# EAGLE design carrier_board (EAGLE 9.5.2)

## Sheet 1 of 5: Main Board
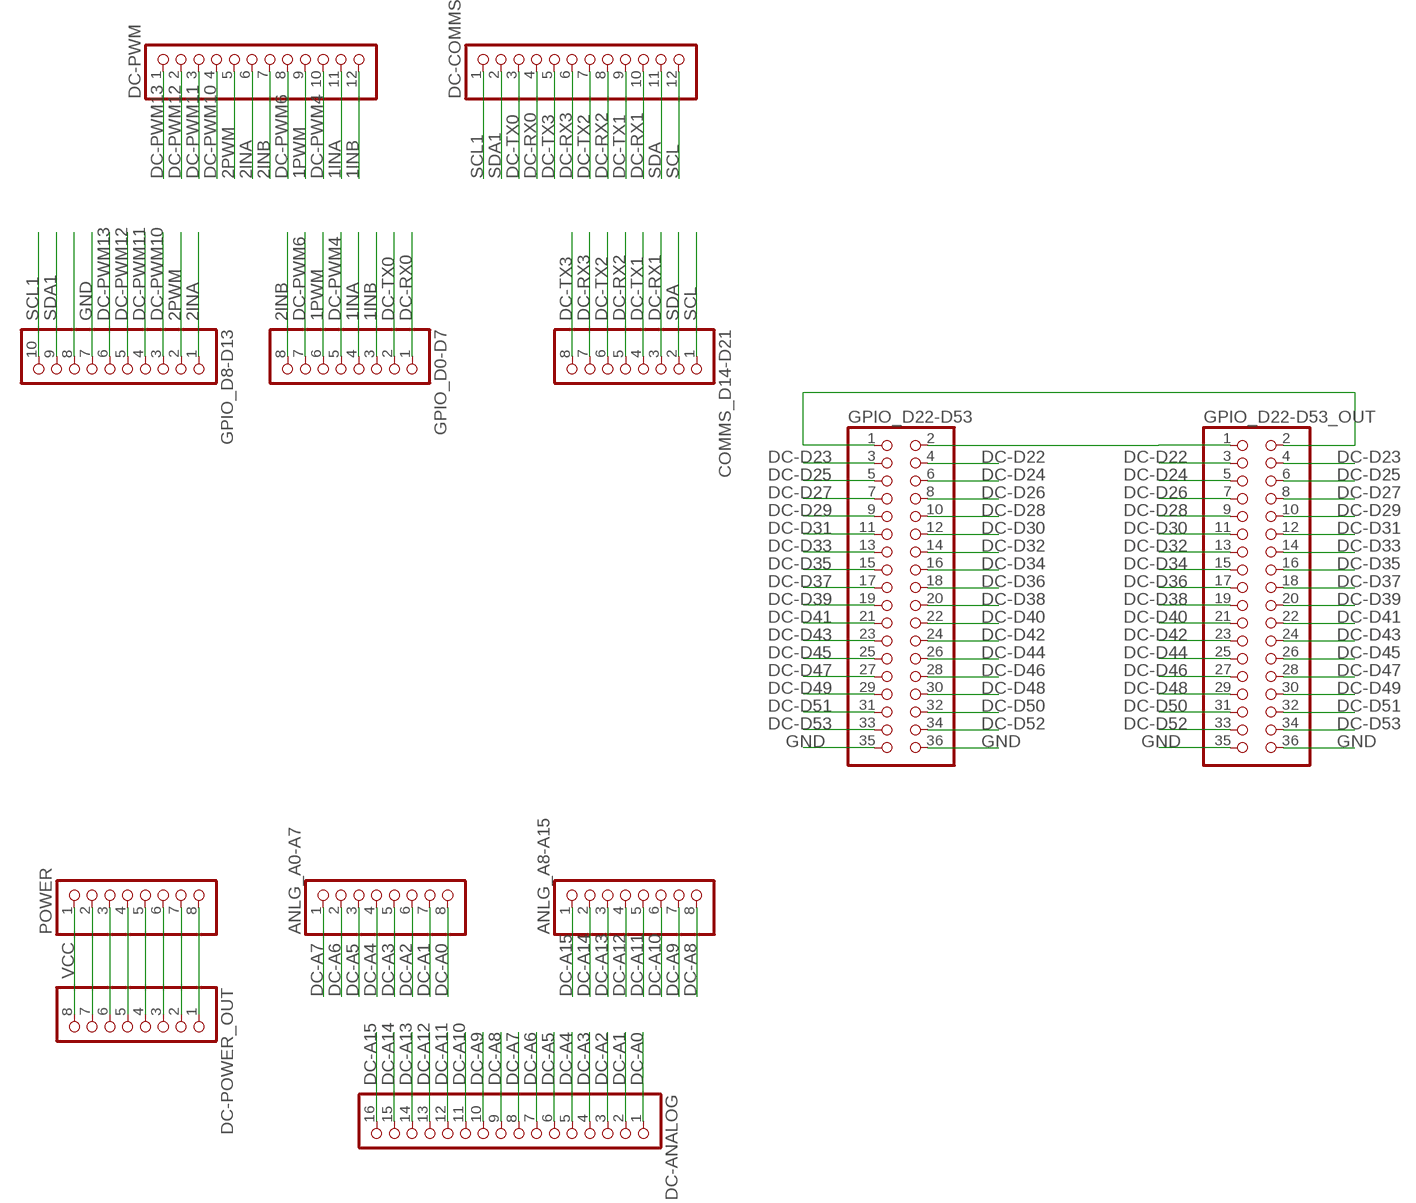
[diagram p0: schematic, sheet 1]

### Parts
ANLG_A0-A7  PINHD-1X8  [1X08]
ANLG_A8-A15  PINHD-1X8  [1X08]
COMMS_D14-D21  PINHD-1X8  [1X08]
DC-ANALOG  PINHD-1X16  [1X16]
DC-COMMS  PINHD-1X12  [1X12]
DC-POWER_OUT  PINHD-1X8  [1X08]
DC-PWM  PINHD-1X12  [1X12]
GPIO_D0-D7  PINHD-1X8  [1X08]
GPIO_D8-D13  PINHD-1X10  [1X10]
GPIO_D22-D53  PINHD-2X18  [2X18]
GPIO_D22-D53_OUT  PINHD-2X18  [2X18]
POWER  PINHD-1X8  [1X08]

### Nets
1INA: DC-PWM.11 GPIO_D0-D7.4 ; also sheet 5
1INB: DC-PWM.12 GPIO_D0-D7.3 ; also sheet 5
1PWM: DC-PWM.9 GPIO_D0-D7.6 ; also sheet 5
2INA: DC-PWM.6 GPIO_D8-D13.1 ; also sheet 5
2INB: DC-PWM.7 GPIO_D0-D7.8 ; also sheet 5
2PWM: DC-PWM.5 GPIO_D8-D13.2 ; also sheet 5
DC-A0: ANLG_A0-A7.8 DC-ANALOG.1
DC-A1: ANLG_A0-A7.7 DC-ANALOG.2
DC-A2: ANLG_A0-A7.6 DC-ANALOG.3
DC-A3: ANLG_A0-A7.5 DC-ANALOG.4
DC-A4: ANLG_A0-A7.4 DC-ANALOG.5
DC-A5: ANLG_A0-A7.3 DC-ANALOG.6
DC-A6: ANLG_A0-A7.2 DC-ANALOG.7
DC-A7: ANLG_A0-A7.1 DC-ANALOG.8
DC-A8: ANLG_A8-A15.8 DC-ANALOG.9
DC-A9: ANLG_A8-A15.7 DC-ANALOG.10
DC-A10: ANLG_A8-A15.6 DC-ANALOG.11
DC-A11: ANLG_A8-A15.5 DC-ANALOG.12
DC-A12: ANLG_A8-A15.4 DC-ANALOG.13
DC-A13: ANLG_A8-A15.3 DC-ANALOG.14
DC-A14: ANLG_A8-A15.2 DC-ANALOG.15
DC-A15: ANLG_A8-A15.1 DC-ANALOG.16
DC-D22: GPIO_D22-D53.4 GPIO_D22-D53_OUT.3
DC-D23: GPIO_D22-D53.3 GPIO_D22-D53_OUT.4
DC-D24: GPIO_D22-D53.6 GPIO_D22-D53_OUT.5
DC-D25: GPIO_D22-D53.5 GPIO_D22-D53_OUT.6
DC-D26: GPIO_D22-D53.8 GPIO_D22-D53_OUT.7
DC-D27: GPIO_D22-D53.7 GPIO_D22-D53_OUT.8
DC-D28: GPIO_D22-D53.10 GPIO_D22-D53_OUT.9
DC-D29: GPIO_D22-D53.9 GPIO_D22-D53_OUT.10
DC-D30: GPIO_D22-D53.12 GPIO_D22-D53_OUT.11
DC-D31: GPIO_D22-D53.11 GPIO_D22-D53_OUT.12
DC-D32: GPIO_D22-D53.14 GPIO_D22-D53_OUT.13
DC-D33: GPIO_D22-D53.13 GPIO_D22-D53_OUT.14
DC-D34: GPIO_D22-D53.16 GPIO_D22-D53_OUT.15
DC-D35: GPIO_D22-D53.15 GPIO_D22-D53_OUT.16
DC-D36: GPIO_D22-D53.18 GPIO_D22-D53_OUT.17
DC-D37: GPIO_D22-D53.17 GPIO_D22-D53_OUT.18
DC-D38: GPIO_D22-D53.20 GPIO_D22-D53_OUT.19
DC-D39: GPIO_D22-D53.19 GPIO_D22-D53_OUT.20
DC-D40: GPIO_D22-D53.22 GPIO_D22-D53_OUT.21
DC-D41: GPIO_D22-D53.21 GPIO_D22-D53_OUT.22
DC-D42: GPIO_D22-D53.24 GPIO_D22-D53_OUT.23
DC-D43: GPIO_D22-D53.23 GPIO_D22-D53_OUT.24
DC-D44: GPIO_D22-D53.26 GPIO_D22-D53_OUT.25
DC-D45: GPIO_D22-D53.25 GPIO_D22-D53_OUT.26
DC-D46: GPIO_D22-D53.28 GPIO_D22-D53_OUT.27
DC-D47: GPIO_D22-D53.27 GPIO_D22-D53_OUT.28
DC-D48: GPIO_D22-D53.30 GPIO_D22-D53_OUT.29
DC-D49: GPIO_D22-D53.29 GPIO_D22-D53_OUT.30
DC-D50: GPIO_D22-D53.32 GPIO_D22-D53_OUT.31
DC-D51: GPIO_D22-D53.31 GPIO_D22-D53_OUT.32
DC-D52: GPIO_D22-D53.34 GPIO_D22-D53_OUT.33
DC-D53: GPIO_D22-D53.33 GPIO_D22-D53_OUT.34
DC-PWM4: DC-PWM.10 GPIO_D0-D7.5
DC-PWM6: DC-PWM.8 GPIO_D0-D7.7
DC-PWM10: DC-PWM.4 GPIO_D8-D13.3
DC-PWM11: DC-PWM.3 GPIO_D8-D13.4
DC-PWM12: DC-PWM.2 GPIO_D8-D13.5
DC-PWM13: DC-PWM.1 GPIO_D8-D13.6
DC-RX0: DC-COMMS.4 GPIO_D0-D7.1
DC-RX1: COMMS_D14-D21.3 DC-COMMS.10
DC-RX2: COMMS_D14-D21.5 DC-COMMS.8
DC-RX3: COMMS_D14-D21.7 DC-COMMS.6
DC-TX0: DC-COMMS.3 GPIO_D0-D7.2
DC-TX1: COMMS_D14-D21.4 DC-COMMS.9
DC-TX2: COMMS_D14-D21.6 DC-COMMS.7
DC-TX3: COMMS_D14-D21.8 DC-COMMS.5
GND: GPIO_D8-D13.7 GPIO_D22-D53.35 GPIO_D22-D53.36 GPIO_D22-D53_OUT.35 GPIO_D22-D53_OUT.36 ; also sheet 2,3,4,5
N$6: GPIO_D22-D53.1 GPIO_D22-D53_OUT.2
N$7: GPIO_D22-D53.2 GPIO_D22-D53_OUT.1
N$9: DC-POWER_OUT.1 POWER.8
N$16: GPIO_D8-D13.8
N$52: DC-POWER_OUT.2 POWER.7
N$53: DC-POWER_OUT.3 POWER.6
N$54: DC-POWER_OUT.4 POWER.5
N$55: DC-POWER_OUT.5 POWER.4
N$56: DC-POWER_OUT.6 POWER.3
N$57: DC-POWER_OUT.7 POWER.2
SCL: COMMS_D14-D21.1 DC-COMMS.12 ; also sheet 2,3
SCL1: DC-COMMS.1 GPIO_D8-D13.10
SDA: COMMS_D14-D21.2 DC-COMMS.11 ; also sheet 2,3
SDA1: DC-COMMS.2 GPIO_D8-D13.9
VCC: DC-POWER_OUT.8 POWER.1 ; also sheet 2,3,4,5

## Sheet 2 of 5: Encoder Nano
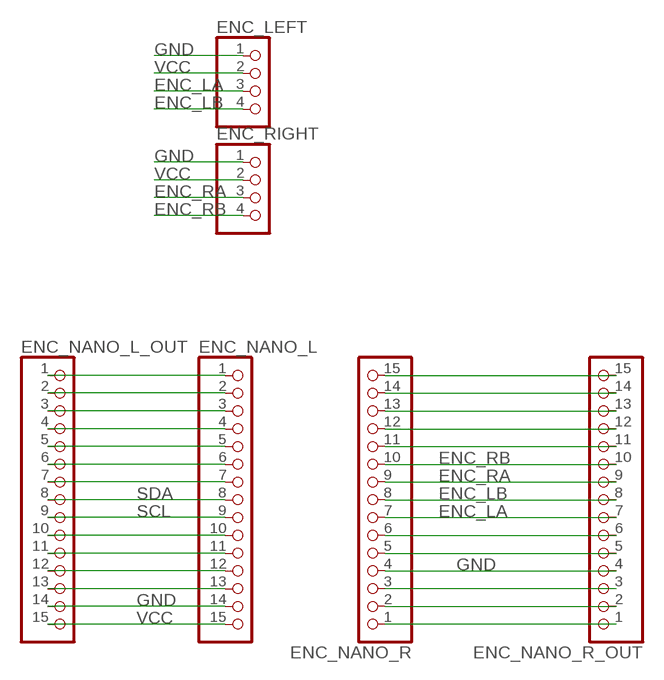
[diagram p1: schematic, sheet 2]

### Parts
ENC_LEFT  PINHD-1X4/90  [1X04/90]
ENC_NANO_L  PINHD-1X15  [1X15]
ENC_NANO_L_OUT  PINHD-1X15  [1X15]
ENC_NANO_R  PINHD-1X15  [1X15]
ENC_NANO_R_OUT  PINHD-1X15  [1X15]
ENC_RIGHT  PINHD-1X4/90  [1X04/90]

### Nets
ENC_LA: ENC_LEFT.3 ENC_NANO_R.7 ENC_NANO_R_OUT.7
ENC_LB: ENC_LEFT.4 ENC_NANO_R.8 ENC_NANO_R_OUT.8
ENC_RA: ENC_NANO_R.9 ENC_NANO_R_OUT.9 ENC_RIGHT.3
ENC_RB: ENC_NANO_R.10 ENC_NANO_R_OUT.10 ENC_RIGHT.4
GND: ENC_LEFT.1 ENC_NANO_L.14 ENC_NANO_L_OUT.14 ENC_NANO_R.4 ENC_NANO_R_OUT.4 ENC_RIGHT.1 ; also sheet 1,3,4,5
N$10: ENC_NANO_L.13 ENC_NANO_L_OUT.13
N$11: ENC_NANO_L.12 ENC_NANO_L_OUT.12
N$12: ENC_NANO_L.11 ENC_NANO_L_OUT.11
N$13: ENC_NANO_L.10 ENC_NANO_L_OUT.10
N$14: ENC_NANO_L.7 ENC_NANO_L_OUT.7
N$15: ENC_NANO_L.6 ENC_NANO_L_OUT.6
N$17: ENC_NANO_L.5 ENC_NANO_L_OUT.5
N$18: ENC_NANO_L.4 ENC_NANO_L_OUT.4
N$19: ENC_NANO_L.3 ENC_NANO_L_OUT.3
N$20: ENC_NANO_L.2 ENC_NANO_L_OUT.2
N$21: ENC_NANO_L.1 ENC_NANO_L_OUT.1
N$22: ENC_NANO_R.15 ENC_NANO_R_OUT.15
N$23: ENC_NANO_R.14 ENC_NANO_R_OUT.14
N$24: ENC_NANO_R.13 ENC_NANO_R_OUT.13
N$26: ENC_NANO_R.12 ENC_NANO_R_OUT.12
N$27: ENC_NANO_R.11 ENC_NANO_R_OUT.11
N$28: ENC_NANO_R.6 ENC_NANO_R_OUT.6
N$29: ENC_NANO_R.5 ENC_NANO_R_OUT.5
N$30: ENC_NANO_R.3 ENC_NANO_R_OUT.3
N$31: ENC_NANO_R.2 ENC_NANO_R_OUT.2
N$32: ENC_NANO_R.1 ENC_NANO_R_OUT.1
SCL: ENC_NANO_L.9 ENC_NANO_L_OUT.9 ; also sheet 1,3
SDA: ENC_NANO_L.8 ENC_NANO_L_OUT.8 ; also sheet 1,3
VCC: ENC_LEFT.2 ENC_NANO_L.15 ENC_NANO_L_OUT.15 ENC_RIGHT.2 ; also sheet 1,3,4,5

## Sheet 3 of 5: Ultrasonic Nano
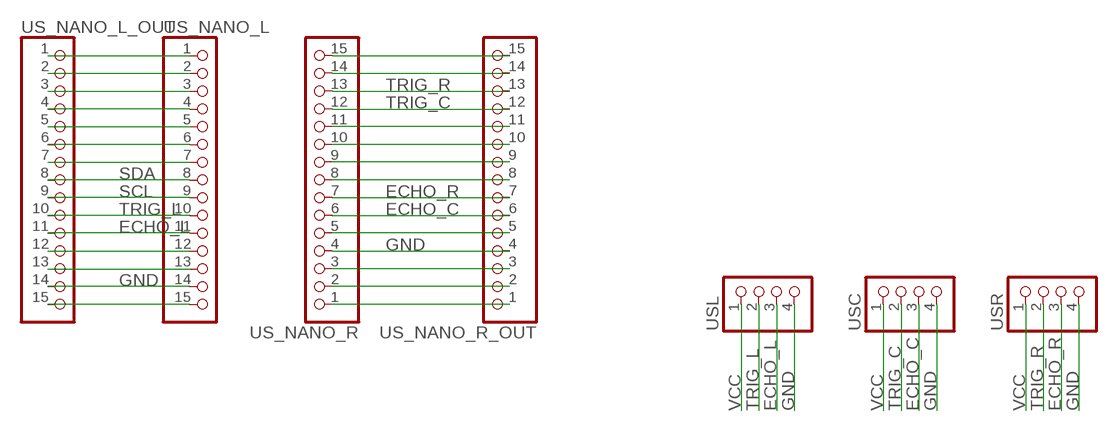
[diagram p2: schematic, sheet 3]

### Parts
US_NANO_L  PINHD-1X15  [1X15]
US_NANO_L_OUT  PINHD-1X15  [1X15]
US_NANO_R  PINHD-1X15  [1X15]
US_NANO_R_OUT  PINHD-1X15  [1X15]
USC  PINHD-1X4/90  [1X04/90]
USL  PINHD-1X4/90  [1X04/90]
USR  PINHD-1X4/90  [1X04/90]

### Nets
ECHO_C: US_NANO_R.6 US_NANO_R_OUT.6 USC.3
ECHO_L: US_NANO_L.11 US_NANO_L_OUT.11 USL.3
ECHO_R: US_NANO_R.7 US_NANO_R_OUT.7 USR.3
GND: US_NANO_L.14 US_NANO_L_OUT.14 US_NANO_R.4 US_NANO_R_OUT.4 USC.4 USL.4 USR.4 ; also sheet 1,2,4,5
N$33: US_NANO_R.15 US_NANO_R_OUT.15
N$34: US_NANO_R.14 US_NANO_R_OUT.14
N$35: US_NANO_R.11 US_NANO_R_OUT.11
N$36: US_NANO_R.10 US_NANO_R_OUT.10
N$37: US_NANO_R.9 US_NANO_R_OUT.9
N$38: US_NANO_R.8 US_NANO_R_OUT.8
N$39: US_NANO_R.5 US_NANO_R_OUT.5
N$40: US_NANO_R.3 US_NANO_R_OUT.3
N$41: US_NANO_R.2 US_NANO_R_OUT.2
N$42: US_NANO_R.1 US_NANO_R_OUT.1
N$43: US_NANO_L.1 US_NANO_L_OUT.1
N$44: US_NANO_L.2 US_NANO_L_OUT.2
N$45: US_NANO_L.3 US_NANO_L_OUT.3
N$46: US_NANO_L.4 US_NANO_L_OUT.4
N$47: US_NANO_L.5 US_NANO_L_OUT.5
N$48: US_NANO_L.6 US_NANO_L_OUT.6
N$49: US_NANO_L.7 US_NANO_L_OUT.7
N$50: US_NANO_L.12 US_NANO_L_OUT.12
N$51: US_NANO_L.13 US_NANO_L_OUT.13
SCL: US_NANO_L.9 US_NANO_L_OUT.9 ; also sheet 1,2
SDA: US_NANO_L.8 US_NANO_L_OUT.8 ; also sheet 1,2
TRIG_C: US_NANO_R.12 US_NANO_R_OUT.12 USC.2
TRIG_L: US_NANO_L.10 US_NANO_L_OUT.10 USL.2
TRIG_R: US_NANO_R.13 US_NANO_R_OUT.13 USR.2
VCC: USC.1 USL.1 USR.1 ; also sheet 1,2,4,5
VCC1: US_NANO_L.15 US_NANO_L_OUT.15

## Sheet 4 of 5: 5v Power board TODO: Remove 3.3 switch
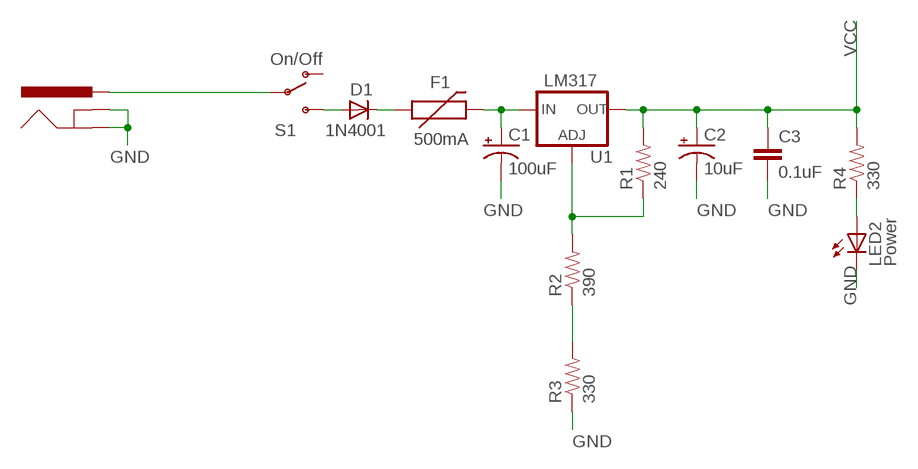
[diagram p3: schematic, sheet 4]

### Parts
C1  100uF  CAP_POLPTH1  [CPOL-RADIAL-100UF-25V]
C2  10uF  CAP_POLPTH2  [CPOL-RADIAL-10UF-25V]
C3  0.1uF  CAPPTH2  [CAP-PTH-SMALL2]
D1  1N4001  DIODEPTH  [DIODE-0.4]
F1  500mA  PTCPTH  [PTC]
J1  POWER_JACKPTH  [POWER_JACK_PTH]
LED2  Power  LED5MM  [LED5MM]
R1  240  RESISTORPTH1  [AXIAL-0.3]
R2  390  RESISTORPTH1  [AXIAL-0.3]
R3  330  RESISTORPTH1  [AXIAL-0.3]
R4  330  RESISTORPTH1  [AXIAL-0.3]
S1  On/Off  SWITCH-SPSTPTH  [SWITCH-SPST]
U1  LM317  V_REG_317SINK  [TO220-ADJ]

### Nets
GND: C1.2(-) C2.2(-) C3.2 J1.GND J1.GNDBREAK LED2.K(C) R3.P$1 ; also sheet 1,2,3,5
N$1: D1.C F1.P$1
N$2: D1.A S1.3(S)
N$3: J1.PWR S1.2(P)
N$4: R2.P$1 R3.P$2
N$5: R1.P$1 R2.P$2 U1.ADJ
N$8: LED2.A R4.P$1
RAW: C1.1(+) F1.P$2 U1.IN
VCC: C2.1(+) C3.1 R1.P$2 R4.P$2 U1.OUT ; also sheet 1,2,3,5
Unconnected: S1.1(O)

## Sheet 5 of 5: Motors/Motor Controllers
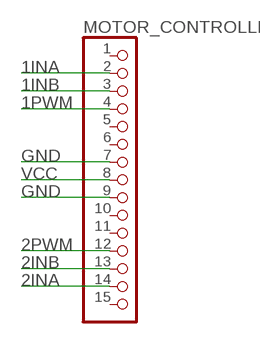
[diagram p4: schematic, sheet 5]

### Parts
MOTOR_CONTROLLER  PINHD-1X15  [1X15]

### Nets
1INA: MOTOR_CONTROLLER.2 ; also sheet 1
1INB: MOTOR_CONTROLLER.3 ; also sheet 1
1PWM: MOTOR_CONTROLLER.4 ; also sheet 1
2INA: MOTOR_CONTROLLER.14 ; also sheet 1
2INB: MOTOR_CONTROLLER.13 ; also sheet 1
2PWM: MOTOR_CONTROLLER.12 ; also sheet 1
GND: MOTOR_CONTROLLER.7 MOTOR_CONTROLLER.9 ; also sheet 1,2,3,4
VCC: MOTOR_CONTROLLER.8 ; also sheet 1,2,3,4
Unconnected: MOTOR_CONTROLLER.1 MOTOR_CONTROLLER.5 MOTOR_CONTROLLER.6 MOTOR_CONTROLLER.10 MOTOR_CONTROLLER.11 MOTOR_CONTROLLER.15

## Library data of the parts
ANLG_A0-A7 ANLG_A8-A15 COMMS_D14-D21 DC-POWER_OUT POWER = pinhead:PINHD-1X8: PIN HEADER
C1 C2 = SparkFun:CAP_POL: Capacitor Polarized These are standard SMD and PTH capacitors. Normally 10uF, 47uF, and 100uF in electrolytic and tantalum varieties. Always verify the external diameter of the through hole cap, it varies with capacity, voltage, and manufacturer. The EIA devices should be standard.
C3 = SparkFun:CAP: Capacitor Standard 0603 ceramic capacitor, and 0.1" leaded capacitor.
D1 = SparkFun:DIODE: Diode These are standard reverse protection diodes and small signal diodes. SMA package can handle up to about 1A. SOD-323 can handle about 200mA. What the SOD-323 package when ordering, there are some mfgs out there that are 5-pin packages.
DC-ANALOG = pinhead:PINHD-1X16: PIN HEADER
DC-COMMS DC-PWM = pinhead:PINHD-1X12: PIN HEADER
ENC_LEFT ENC_RIGHT USC USL USR = pinhead:PINHD-1X4: PIN HEADER
ENC_NANO_L ENC_NANO_L_OUT ENC_NANO_R ENC_NANO_R_OUT MOTOR_CONTROLLER US_NANO_L US_NANO_L_OUT US_NANO_R US_NANO_R_OUT = pinhead:PINHD-1X15: PIN HEADER
F1 = SparkFun:PTC: Resettable Fuse PTC Resettable Fuse. Spark Fun Electronics SKU : COM-08357
GPIO_D0-D7 = pinhead:PINHD-1X8: PIN HEADER; SPICEPREFIX: X
GPIO_D8-D13 = pinhead:PINHD-1X10: PIN HEADER
GPIO_D22-D53 GPIO_D22-D53_OUT = pinhead:PINHD-2X18: PIN HEADER
J1 = SparkFun:POWER_JACK: Power Jack This is the standard 5.5mm barrel jack for power. The PTH is the most common, proven, reliable, footprint. All others are experimental. The Slot footprint only works if the mill layer is transmitted to the PCB fab house so be warned. Spark Fun Electronics SKU : PRT-00119. Mating wall wart : TOL-00298 (and others)
LED2 = SparkFun-Nate:LED
R1-R4 = SparkFun:RESISTOR: Resistor Basic schematic elements and footprints for 0603, 1206, and PTH 1/10th watt (small) resistors.
S1 = SparkFun:SWITCH-SPST: SPST Switch Simple slide switch. Spark Fun Electronics SKU : COM-00102
U1 = SparkFun:V_REG_317: Voltage Regulator Standard LM317 adjustable voltage regulator. AOI (Adjust Output Input). Google 'LM317 Calculator' for easy to use app to get the two resistor values needed. 240/720 for 5V output. 240/390 for 3.3V output. Spark Fun Electronics SKU : COM-00527

## Board
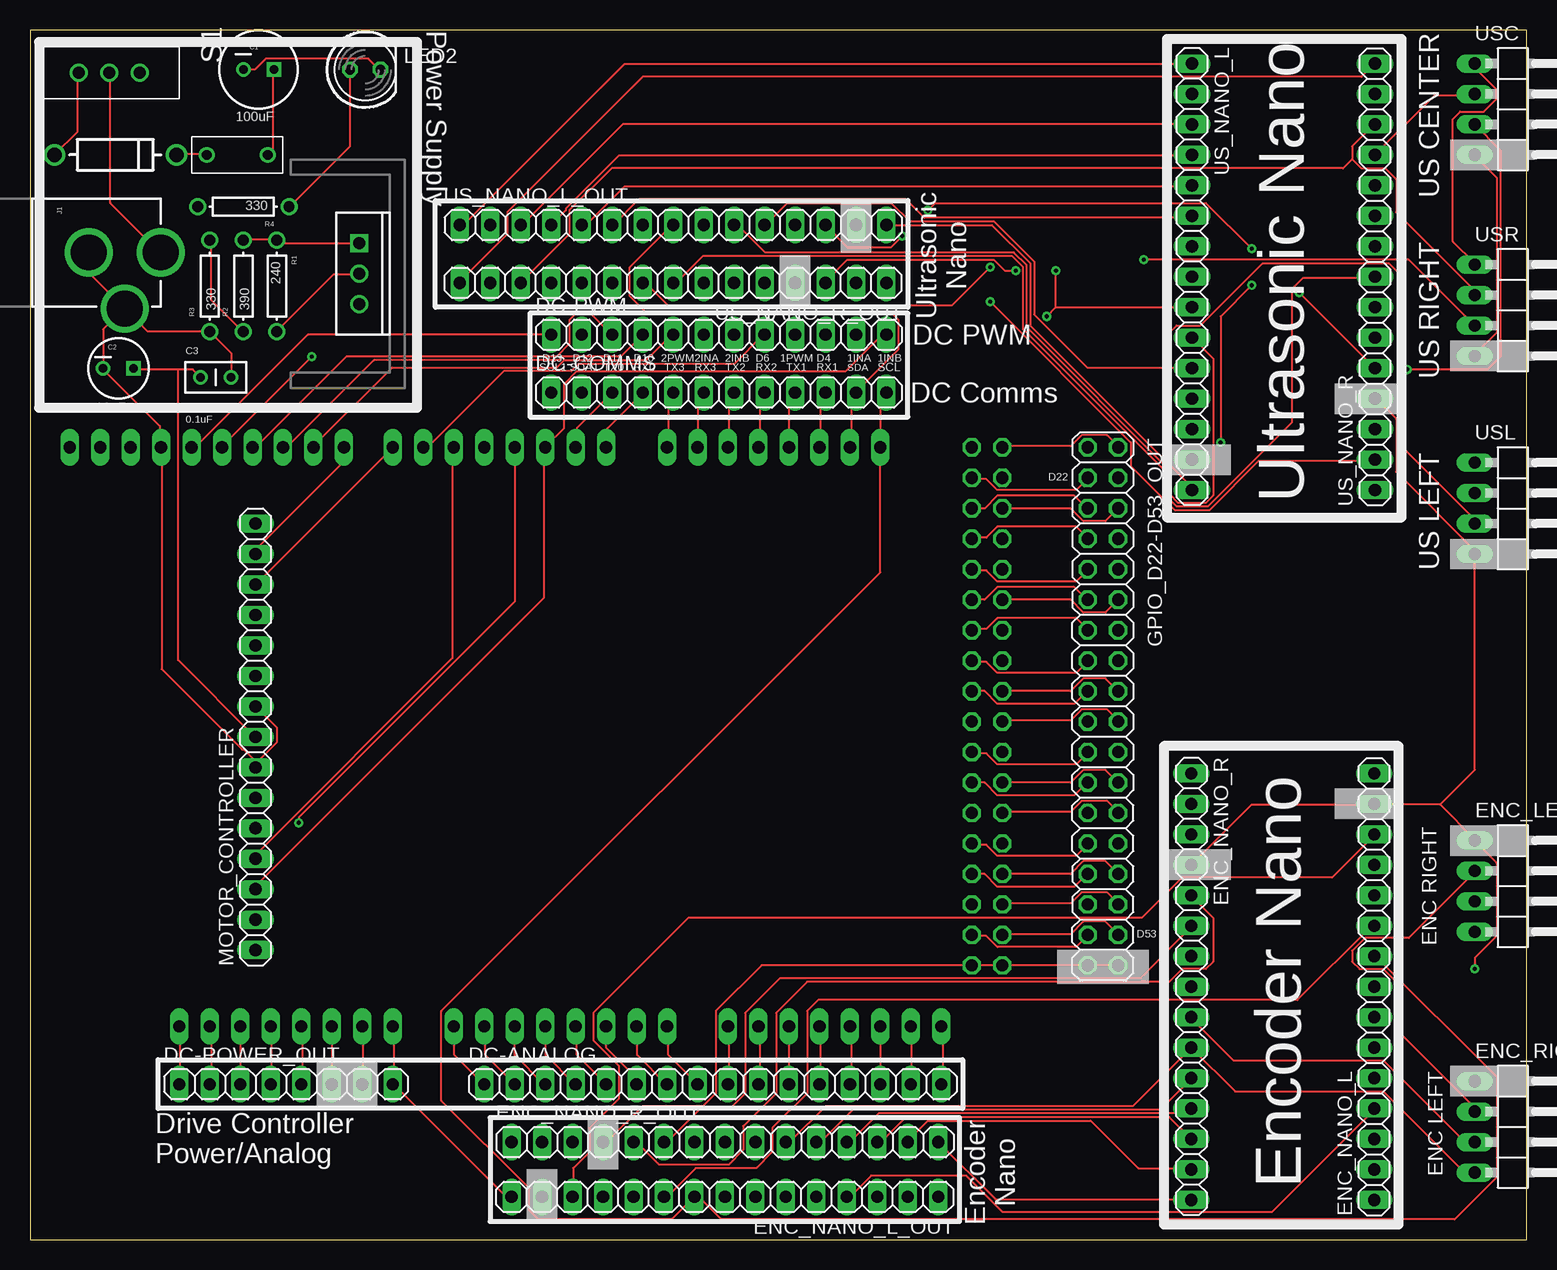
[diagram p5: board, top side]
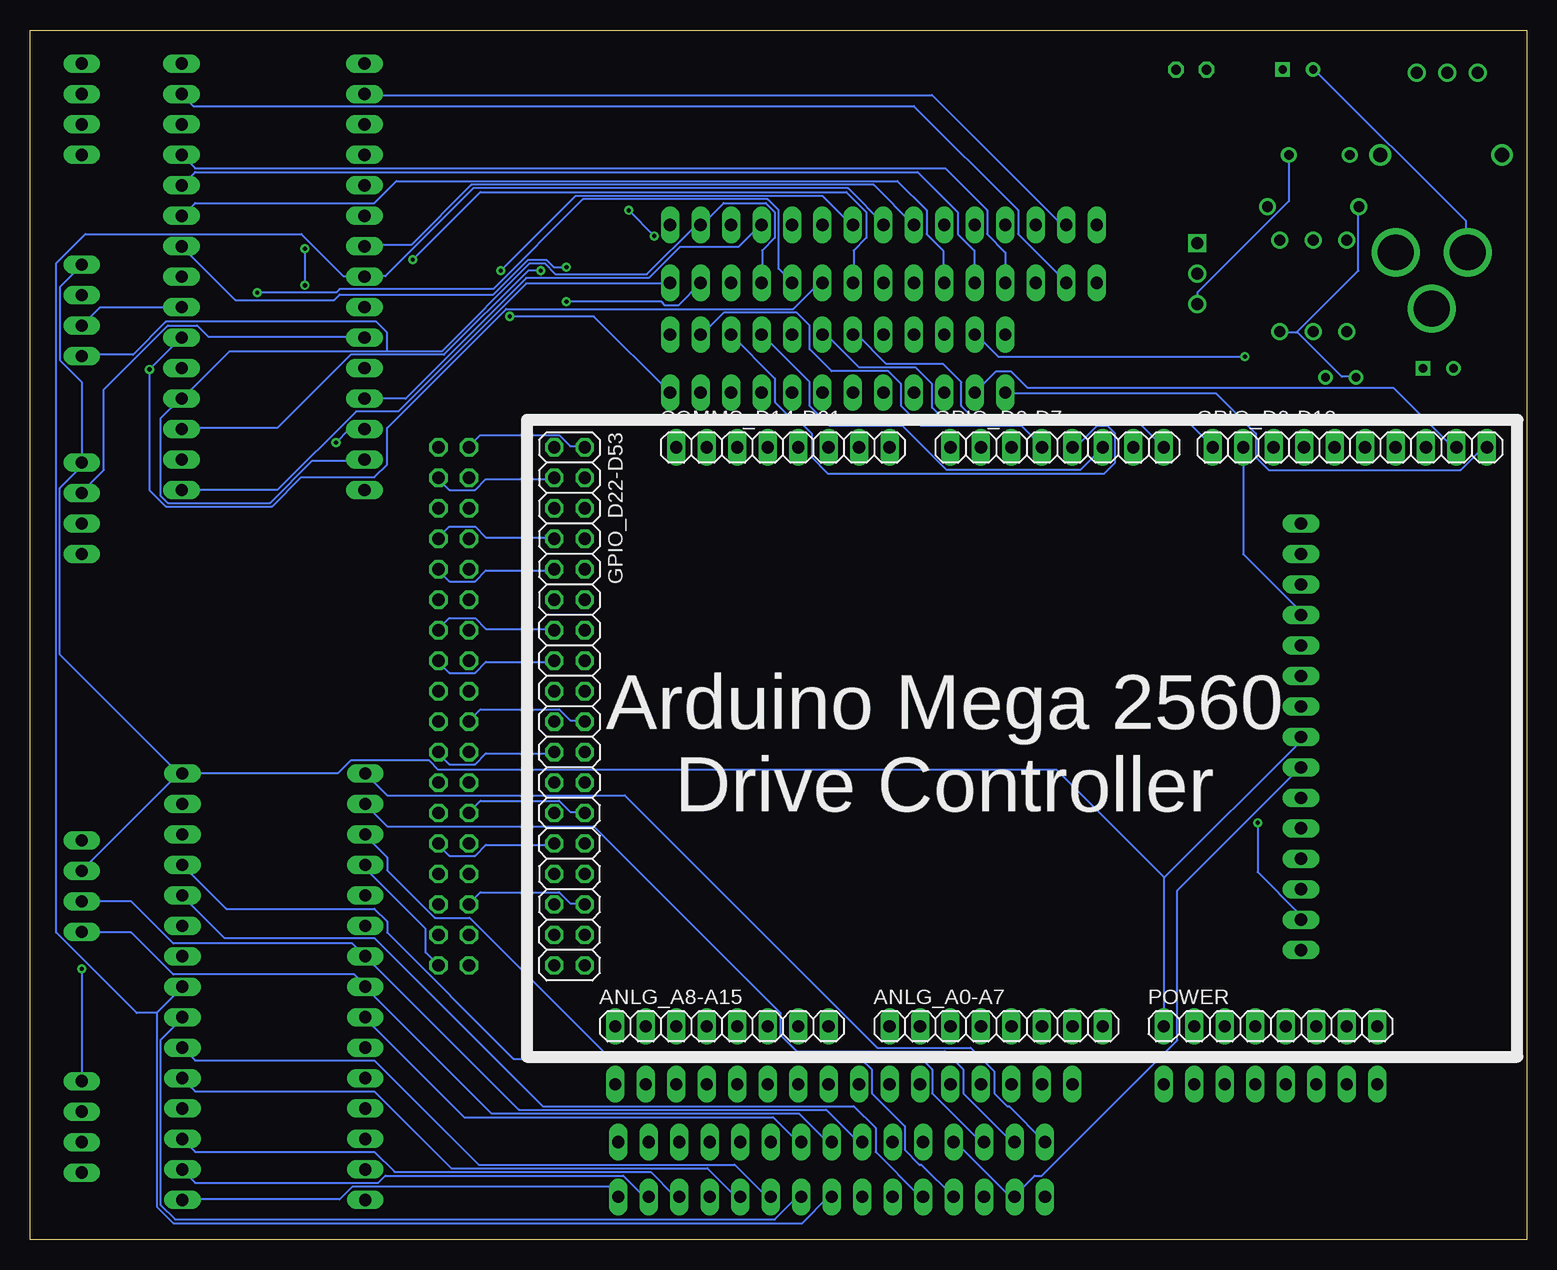
[diagram p6: board, bottom side, seen from below]

Size 124.71 x 100.84 mm. Coordinates in mm from the lower left corner, seen from the top.
Outline: 0,0 124.71,0 124.71,100.84 0,100.84 0,0
Copper layers (1*16): Top 0.035mm / dielectric 1.5mm / Bottom 0.035mm
Design rules "default": minimum track width 6mil, minimum drill 0.35mm, track to track 6mil, track to pad 6mil, pad to pad 6mil, via to via 6mil, smd to smd 6mil, copper to edge 40mil, drill to drill 6mil, minimum pad ring 10mil, minimum via ring 8mil, stop-mask expansion 4mil, vias tented up to drill 0mil, thermal gap 10mil

### Footprints (pad centres in the part's own frame; a part is rotated, then mirrored left to right if it is on the bottom)
1X08 = drill 1.016 long: 1 -8.89,0; 2 -6.35,0; 3 -3.81,0; 4 -1.27,0; 5 1.27,0; 6 3.81,0; 7 6.35,0; 8 8.89,0
CPOL-RADIAL-100UF-25V = drill 0.7 square: 1 1.27,0 | drill 0.7: 2 -1.27,0
CPOL-RADIAL-10UF-25V = drill 0.7 square: 1 1.27,0 | drill 0.7: 2 -1.27,0
CAP-PTH-SMALL2 = drill 0.7: 1 0,0; 2 2.54,0
DIODE-0.4 = drill 1.2: A 0,0; C 10.16,0
1X16 = drill 1.016 long: 1 -19.05,0; 2 -16.51,0; 3 -13.97,0; 4 -11.43,0; 5 -8.89,0; 6 -6.35,0; 7 -3.81,0; 8 -1.27,0; 9 1.27,0; 10 3.81,0; 11 6.35,0; 12 8.89,0; 13 11.43,0; 14 13.97,0; 15 16.51,0; 16 19.05,0
1X12 = drill 1.016 long: 1 -13.97,0; 2 -11.43,0; 3 -8.89,0; 4 -6.35,0; 5 -3.81,0; 6 -1.27,0; 7 1.27,0; 8 3.81,0; 9 6.35,0; 10 8.89,0; 11 11.43,0; 12 13.97,0
1X04/90 = drill 1.016 long: 1 -3.81,-3.81; 2 -1.27,-3.81; 3 1.27,-3.81; 4 3.81,-3.81
1X15 = drill 1.016 long: 1 -17.78,0; 2 -15.24,0; 3 -12.7,0; 4 -10.16,0; 5 -7.62,0; 6 -5.08,0; 7 -2.54,0; 8 0,0; 9 2.54,0; 10 5.08,0; 11 7.62,0; 12 10.16,0; 13 12.7,0; 14 15.24,0; 15 17.78,0
PTC = drill 0.8: P$1 -2.54,0; P$2 2.54,0
1X10 = drill 1.016 long: 1 -11.43,0; 2 -8.89,0; 3 -6.35,0; 4 -3.81,0; 5 -1.27,0; 6 1.27,0; 7 3.81,0; 8 6.35,0; 9 8.89,0; 10 11.43,0
2X18 = drill 1.016 octagon: 1 -21.59,-1.27; 2 -21.59,1.27; 3 -19.05,-1.27; 4 -19.05,1.27; 5 -16.51,-1.27; 6 -16.51,1.27; 7 -13.97,-1.27; 8 -13.97,1.27; 9 -11.43,-1.27; 10 -11.43,1.27; 11 -8.89,-1.27; 12 -8.89,1.27; 13 -6.35,-1.27; 14 -6.35,1.27; 15 -3.81,-1.27; 16 -3.81,1.27; 17 -1.27,-1.27; 18 -1.27,1.27; 19 1.27,-1.27; 20 1.27,1.27; 21 3.81,-1.27; 22 3.81,1.27; 23 6.35,-1.27; 24 6.35,1.27; 25 8.89,-1.27; 26 8.89,1.27; 27 11.43,-1.27; 28 11.43,1.27; 29 13.97,-1.27; 30 13.97,1.27; 31 16.51,-1.27; 32 16.51,1.27; 33 19.05,-1.27; 34 19.05,1.27; 35 21.59,-1.27; 36 21.59,1.27
POWER_JACK_PTH = drill 2.997: GND 0,7.7; GNDBREAK 4.7,10.7; PWR 0,13.7
LED5MM = drill 0.813 octagon: A -1.27,0; K 1.27,0
AXIAL-0.3 = drill 0.9: P$1 -3.81,0; P$2 3.81,0
SWITCH-SPST = drill 1.016: 1 0,2.54; 2 0,0; 3 0,-2.54
TO220-ADJ = drill 1 square: ADJ -2.54,0 | drill 1: IN 2.54,0; OUT 0,0

### Placement (x,y rotation side)
ANLG_A0-A7  44.2,17.78 0 bottom
ANLG_A8-A15  67.06,17.78 0 bottom
C1  19.05,97.54 0 top
C2  7.37,72.64 0 top
C3  14.22,71.88 0 top
COMMS_D14-D21  61.98,66.04 0 bottom
D1  2.03,90.42 0 top
DC-ANALOG  56.9,12.95 0 top
DC-COMMS  57.4,70.61 0 top
DC-POWER_OUT  21.34,12.95 0 top
DC-PWM  57.4,75.44 0 top
ENC_LEFT  124.21,29.46 270 top
ENC_NANO_L  112.01,21.08 90 top
ENC_NANO_L_OUT  57.91,3.56 180 top
ENC_NANO_R  96.77,21.08 270 top
ENC_NANO_R_OUT  57.91,8.13 0 top
ENC_RIGHT  124.21,9.4 270 top
F1  17.27,90.42 0 top
GPIO_D0-D7  39.12,66.04 0 bottom
GPIO_D8-D13  14.73,66.04 0 bottom
GPIO_D22-D53  79.76,44.45 270 bottom
GPIO_D22-D53_OUT  89.41,44.45 270 top
J1  -2.79,82.3 270 top
LED2  27.94,97.54 0 top
MOTOR_CONTROLLER  18.8,41.91 90 top
POWER  21.34,17.78 0 bottom
R1  20.57,79.5 270 top
R2  17.78,79.5 90 top
R3  14.99,79.5 90 top
R4  17.78,86.11 180 top
S1  6.6,97.28 270 top
U1  27.43,80.52 270 top
US_NANO_L  96.84,80.26 270 top
US_NANO_L_OUT  53.59,84.58 0 top
US_NANO_R  112.08,80.26 90 top
US_NANO_R_OUT  53.59,79.76 180 top
USC  124.21,94.23 270 top
USL  124.21,60.96 270 top
USR  124.21,77.47 270 top

### Tracks (layer width: path | path; a pad name or v marks a point on that pad's centre or on a via)
1INA  (via drill 0.35)
  Top 0.152: v22.4,34.75 22.4,35.2 40.39,53.19 GPIO_D0-D7.4
  Bottom 0.152: v22.4,34.75 22.4,30.63 18.9,27.13 18.9,26.67 MOTOR_CONTROLLER.2 | DC-PWM.11 68.73,75.44 66.9,77.27 60.81,77.27 59.74,76.2 59.74,74.22 57.91,72.39 53.19,72.39 52.12,71.32 52.12,69.49 50.44,67.82 42.06,67.82 40.39,66.14 GPIO_D0-D7.4
1INB
  Top 0.152: MOTOR_CONTROLLER.3 18.9,29.26 18.9,29.57 42.82,53.49 42.82,65.99 GPIO_D0-D7.3 42.98,66.14 44.5,67.67 44.5,71.32 45.57,72.39 67.97,72.39 71.02,75.44 DC-PWM.12
1PWM
  Top 0.152: MOTOR_CONTROLLER.4 18.9,31.85 18.9,32.16 35.2,48.46 35.2,65.99 GPIO_D0-D7.6
  Bottom 0.152: GPIO_D0-D7.6 37.19,64.16 48.31,64.16 51.97,67.82 58.06,67.82 59.74,69.49 59.74,71.48 63.7,75.44 DC-PWM.9
2INA
  Top 0.152: MOTOR_CONTROLLER.14 18.9,57.15 18.9,57.61 26.06,64.77 26.06,65.99 GPIO_D8-D13.1
  Bottom 0.152: DC-PWM.6 55.78,75.44 53.34,73 48.62,73 47.09,71.48 47.09,69.49 46.02,68.43 28.5,68.43 26.21,66.14 GPIO_D8-D13.1
2INB
  Top 0.152: GPIO_D0-D7.8 MOTOR_CONTROLLER.13
  Bottom 0.152: DC-PWM.7 58.37,75.44 55.63,72.69 50.9,72.69 49.53,71.32 49.53,69.34 48.31,68.12 32.31,68.12 GPIO_D0-D7.8
2PWM
  Top 0.152: DC-PWM.5 53.49,75.44 51.36,73.3 44.5,73.3 43.89,72.69 30.18,72.69 23.62,66.14 GPIO_D8-D13.2
  Bottom 0.152: GPIO_D8-D13.2 23.62,57.15 18.9,52.43 18.9,52.12 MOTOR_CONTROLLER.12
DC-A0
  Top 0.152: ANLG_A0-A7.8 35.36,17.68 35.36,15.39 37.8,12.95 DC-ANALOG.1
DC-A1
  Top 0.152: DC-ANALOG.2 37.95,15.39 37.95,17.68 ANLG_A0-A7.7
DC-A2
  Top 0.152: ANLG_A0-A7.6 40.39,15.39 42.82,12.95 DC-ANALOG.3
DC-A3
  Top 0.152: ANLG_A0-A7.5 42.98,17.68 42.98,15.39 45.41,12.95 DC-ANALOG.4
DC-A4
  Top 0.152: DC-ANALOG.5 45.57,15.39 45.57,17.68 ANLG_A0-A7.4
DC-A5
  Top 0.152: ANLG_A0-A7.3 48.01,16 50.44,13.56 50.44,12.95 DC-ANALOG.6
DC-A6
  Top 0.152: ANLG_A0-A7.2 50.6,17.68 50.6,15.39 53.03,12.95 DC-ANALOG.7
DC-A7
  Top 0.152: DC-ANALOG.8 53.19,15.39 53.19,17.68 ANLG_A0-A7.1
DC-A8
  Top 0.152: DC-ANALOG.9 58.22,12.95 58.22,17.68 ANLG_A8-A15.8
DC-A9
  Top 0.152: DC-ANALOG.10 60.81,12.95 60.81,17.68 ANLG_A8-A15.7
DC-A10
  Top 0.152: ANLG_A8-A15.6 DC-ANALOG.11
DC-A11
  Top 0.152: DC-ANALOG.12 65.84,12.95 65.84,17.68 ANLG_A8-A15.5
DC-A12
  Top 0.152: DC-ANALOG.13 68.43,12.95 68.43,17.68 ANLG_A8-A15.4
DC-A13
  Top 0.152: ANLG_A8-A15.3 DC-ANALOG.14
DC-A14
  Top 0.152: DC-ANALOG.15 73.46,12.95 73.46,17.68 ANLG_A8-A15.2
DC-A15
  Top 0.152: DC-ANALOG.16 76.05,12.95 76.05,17.68 ANLG_A8-A15.1
DC-D22
  Top 0.152: GPIO_D22-D53.4 78.49,63.4 79.7,63.4 80.62,62.48 87.17,62.48 88.09,63.4 GPIO_D22-D53_OUT.3
DC-D23
  Bottom 0.152: GPIO_D22-D53.3 81.08,63.4 86.72,63.4 87.63,62.48 89.76,62.48 90.68,63.4 GPIO_D22-D53_OUT.4
DC-D24
  Top 0.152: GPIO_D22-D53.6 79.55,60.96 80.62,62.03 87.02,62.03 88.09,60.96 GPIO_D22-D53_OUT.5
DC-D25
  Top 0.152: GPIO_D22-D53.5 86.72,60.96 87.78,59.89 89.61,59.89 GPIO_D22-D53_OUT.6
DC-D26
  Top 0.152: GPIO_D22-D53.8 78.49,58.52 79.7,58.52 80.62,59.44 87.17,59.44 88.09,58.52 GPIO_D22-D53_OUT.7
DC-D27
  Bottom 0.152: GPIO_D22-D53.7 81.08,58.52 86.72,58.52 87.63,59.44 89.76,59.44 90.68,58.52 GPIO_D22-D53_OUT.8
DC-D28
  Top 0.152: GPIO_D22-D53.10 78.49,55.78 79.7,55.78 80.62,54.86 87.17,54.86 88.09,55.78 GPIO_D22-D53_OUT.9
DC-D29
  Bottom 0.152: GPIO_D22-D53.9 81.08,55.78 86.72,55.78 87.63,54.86 89.76,54.86 90.68,55.78 GPIO_D22-D53_OUT.10
DC-D30
  Top 0.152: GPIO_D22-D53.12 79.55,53.34 80.62,54.41 87.02,54.41 88.09,53.34 GPIO_D22-D53_OUT.11
DC-D31
  Top 0.152: GPIO_D22-D53.11 86.72,53.34 87.78,52.27 89.61,52.27 GPIO_D22-D53_OUT.12
DC-D32
  Top 0.152: GPIO_D22-D53.14 78.49,50.9 79.7,50.9 80.62,51.82 87.17,51.82 88.09,50.9 GPIO_D22-D53_OUT.13
DC-D33
  Bottom 0.152: GPIO_D22-D53.13 81.08,50.9 86.72,50.9 87.63,51.82 89.76,51.82 90.68,50.9 GPIO_D22-D53_OUT.14
DC-D34
  Top 0.152: GPIO_D22-D53.16 78.49,48.16 79.7,48.16 80.62,47.24 87.17,47.24 88.09,48.16 GPIO_D22-D53_OUT.15
DC-D35
  Bottom 0.152: GPIO_D22-D53.15 81.08,48.16 86.72,48.16 87.63,47.24 89.76,47.24 90.68,48.16 GPIO_D22-D53_OUT.16
DC-D36
  Top 0.152: GPIO_D22-D53.18 79.55,45.72 80.62,44.65 87.02,44.65 88.09,45.72 GPIO_D22-D53_OUT.17
DC-D37
  Top 0.152: GPIO_D22-D53.17 86.72,45.72 87.78,46.79 89.61,46.79 GPIO_D22-D53_OUT.18
DC-D38
  Bottom 0.152: GPIO_D22-D53.20 78.49,43.28 79.7,43.28 80.62,44.2 87.17,44.2 88.09,43.28 GPIO_D22-D53_OUT.19
DC-D39
  Top 0.152: GPIO_D22-D53.19 81.08,43.28 86.72,43.28 87.63,44.2 89.76,44.2 90.68,43.28 GPIO_D22-D53_OUT.20
DC-D40
  Top 0.152: GPIO_D22-D53.22 78.49,40.54 79.7,40.54 80.62,39.62 87.17,39.62 88.09,40.54 GPIO_D22-D53_OUT.21
DC-D41
  Bottom 0.152: GPIO_D22-D53.21 81.08,40.54 86.72,40.54 87.63,39.62 89.76,39.62 90.68,40.54 GPIO_D22-D53_OUT.22
DC-D42
  Top 0.152: GPIO_D22-D53.24 79.55,38.1 80.62,37.03 87.02,37.03 88.09,38.1 GPIO_D22-D53_OUT.23
DC-D43
  Top 0.152: GPIO_D22-D53.23 86.72,38.1 87.78,39.17 89.61,39.17 GPIO_D22-D53_OUT.24
DC-D44
  Bottom 0.152: GPIO_D22-D53.26 78.49,35.66 79.7,35.66 80.62,36.58 87.17,36.58 88.09,35.66 GPIO_D22-D53_OUT.25
DC-D45
  Top 0.152: GPIO_D22-D53.25 81.08,35.66 86.72,35.66 87.63,36.58 89.76,36.58 90.68,35.66 GPIO_D22-D53_OUT.26
DC-D46
  Top 0.152: GPIO_D22-D53.28 78.49,32.92 79.7,32.92 80.62,32 87.17,32 88.09,32.92 GPIO_D22-D53_OUT.27
DC-D47
  Bottom 0.152: GPIO_D22-D53.27 81.08,32.92 86.72,32.92 87.63,32 89.76,32 90.68,32.92 GPIO_D22-D53_OUT.28
DC-D48
  Top 0.152: GPIO_D22-D53.30 79.55,30.48 80.62,29.41 87.02,29.41 88.09,30.48 GPIO_D22-D53_OUT.29
DC-D49
  Top 0.152: GPIO_D22-D53.29 86.72,30.48 87.78,31.55 89.61,31.55 GPIO_D22-D53_OUT.30
DC-D50
  Bottom 0.152: GPIO_D22-D53.32 78.49,28.04 79.7,28.04 80.62,28.96 87.17,28.96 88.09,28.04 GPIO_D22-D53_OUT.31
DC-D51
  Top 0.152: GPIO_D22-D53.31 81.08,28.04 86.72,28.04 87.63,28.96 89.76,28.96 90.68,28.04 GPIO_D22-D53_OUT.32
DC-D52
  Top 0.152: GPIO_D22-D53.34 78.49,25.3 79.7,25.3 80.62,24.38 87.17,24.38 88.09,25.3 GPIO_D22-D53_OUT.33
DC-D53
  Top 0.152: GPIO_D22-D53.33 81.08,25.45 86.72,25.45 87.78,26.52 89.61,26.52 90.68,25.45 GPIO_D22-D53_OUT.34
DC-PWM4
  Bottom 0.152: DC-PWM.10 62.64,71.78 62.64,69.8 61.57,68.73 61.11,68.73 59.59,67.21 59.59,65.23 58.22,63.86 35.2,63.86 34.29,64.77 34.29,67.21 34.9,67.82 35.81,67.82 37.49,66.14 37.8,66.14 GPIO_D0-D7.5
DC-PWM6
  Top 0.152: GPIO_D0-D7.7 32.77,66.14 33.22,66.14 39.47,72.39 45.11,72.39 45.72,73 58.67,73 61.11,75.44 DC-PWM.8
DC-PWM10
  Top 0.152: DC-PWM.4 49.23,73.61 44.35,73.61 44.04,73.3 28.65,73.3 21.49,66.14 21.18,66.14 GPIO_D8-D13.3
DC-PWM11
  Top 0.152: GPIO_D8-D13.4 18.59,66.14 18.9,66.14 26.36,73.61 43.89,73.61 44.96,74.68 44.96,76.66 45.57,77.27 46.63,77.27 48.46,75.44 DC-PWM.3
DC-PWM12  (via drill 0.35)
  Top 0.152: v23.47,73.61 16,66.14 GPIO_D8-D13.5
  Bottom 0.152: v23.47,73.61 44.04,73.61 45.87,75.44 DC-PWM.2
DC-PWM13
  Top 0.152: DC-PWM.1 23.16,75.44 13.87,66.14 13.56,66.14 GPIO_D8-D13.6
DC-RX0
  Top 0.152: GPIO_D0-D7.1 48.01,67.51 51.05,70.56 DC-COMMS.4
DC-RX1
  Top 0.152: COMMS_D14-D21.3 65.84,66.14 65.84,70.1 66.29,70.56 DC-COMMS.10
DC-RX2
  Top 0.152: COMMS_D14-D21.5 60.81,66.14 60.81,70.26 61.11,70.56 DC-COMMS.8
DC-RX3
  Top 0.152: COMMS_D14-D21.7 55.63,70.1 DC-COMMS.6
DC-TX0
  Top 0.152: DC-COMMS.3 45.57,67.67 45.57,66.14 GPIO_D0-D7.2
DC-TX1
  Top 0.152: COMMS_D14-D21.4 63.25,70.1 DC-COMMS.9
DC-TX2
  Top 0.152: COMMS_D14-D21.6 58.22,66.14 58.22,70.1 58.67,70.56 DC-COMMS.7
DC-TX3
  Top 0.152: COMMS_D14-D21.8 53.19,66.14 53.19,70.26 53.49,70.56 DC-COMMS.5
ECHO_C  (via drill 0.35)
  Top 0.152: v114.76,72.54 121.46,72.54 122.53,73.61 122.53,90.83 USC.3
  Bottom 0.152: US_NANO_R.6 112.17,75.13 v114.76,72.54 114.76,62.48 113.39,61.11 104.55,61.11 102.11,63.55 96.01,63.55 94.94,64.62 94.94,67.67 85.04,77.57 61.11,77.57 58.98,79.7 58.67,79.7 US_NANO_R_OUT.6
ECHO_L
  Top 0.152: 94.94,72.69 88.09,72.69 83.67,77.11 83.67,81.53 80.31,84.89 73.3,84.89 71.78,86.41 63.09,86.41 61.27,84.58 US_NANO_L_OUT.11 | 94.94,72.69 96.77,72.69 US_NANO_L.11 | USL.3 120.4,60.05 114.15,66.29 114.15,80.47 113.23,81.38 102.72,81.38 97.54,76.2 95.56,76.2 94.94,75.59 94.94,72.69
ECHO_R  (via drill 0.35)
  Top 0.152: v92.81,81.69 114.91,81.69 USR.3
  Bottom 0.152: US_NANO_R.7 118.87,77.72 USR.3 | v92.81,81.69 87.17,87.33 56.69,87.33 55.02,85.65 55.02,83.52 56.08,82.45 56.08,79.86 US_NANO_R_OUT.7
ENC_LA
  Bottom 0.152: ENC_NANO_R_OUT.7 55.47,8.23 55.78,8.23 58.37,10.82 83.97,10.82 ENC_NANO_R.7 97.84,24.69 112.78,24.69 116.28,28.19 ENC_LEFT.3
ENC_LB
  Bottom 0.152: ENC_NANO_R_OUT.8 57.91,8.23 58.37,8.23 60.66,10.52 86.26,10.52 96.77,21.03 ENC_NANO_R.8 96.77,21.18 97.69,22.1 112.78,22.1 116.28,25.6 120.4,25.6 ENC_LEFT.4
ENC_RA
  Top 0.152: ENC_RIGHT.3 120.4,8.23 119.48,8.23 112.78,14.94 100.28,14.94 96.77,18.44 ENC_NANO_R.9
  Bottom 0.152: ENC_NANO_R_OUT.9 60.5,8.23 60.81,8.23 62.79,10.21 88.54,10.21 96.77,18.44 ENC_NANO_R.9
ENC_RB
  Top 0.152: ENC_NANO_R_OUT.10 63.09,8.23 63.4,8.23 66.29,11.12 91.9,11.12 ENC_NANO_R.10 100.43,12.34 112.78,12.34 119.48,5.64 120.4,5.64 ENC_RIGHT.4
GND  (via drill 0.35)
  Top 0.152: USR.4 120.4,73.76 122.22,75.59 122.22,88.54 120.4,90.37 USC.4 | US_NANO_R.4 112.17,70.1 113.84,68.43 113.84,64.01 120.4,57.45 USL.4 120.4,39.17 117.5,36.27 | C1.2 18.75,97.54 19.66,98.45 28.19,98.45 29.11,97.54 LED2.K | 18.9,39.78 18.9,39.47 MOTOR_CONTROLLER.7 18.9,39.78 | 18.9,39.78 20.57,41.45 20.57,42.67 MOTOR_CONTROLLER.9 | C3.2 16.76,73.91 R3.P$1 14.94,75.74 9.75,75.74 7.92,77.57 J1.GNDBREAK | J1.GNDBREAK 7.77,77.57 6.1,75.89 C2.2 6.1,72.54 10.82,67.82 10.82,66.14 GPIO_D8-D13.7 10.97,65.99 10.97,47.55 17.68,40.84 17.83,40.84 18.9,39.78 | J1.GND 5.03,82.3 5.03,80.47 7.77,77.72 J1.GNDBREAK | v120.4,22.55 120.4,23.47 122.22,25.3 122.22,31.39 120.4,33.22 ENC_LEFT.1 120.4,33.38 117.5,36.27 | 117.5,36.27 112.01,36.27 | GPIO_D22-D53_OUT.36 GPIO_D22-D53_OUT.35 GPIO_D22-D53.35 GPIO_D22-D53.36 60.96,22.86 57.15,19.05 57.15,12.19 56.08,11.12 51.05,11.12 48.16,8.23 47.85,8.23 ENC_NANO_R_OUT.4 | 112.01,36.27 101.8,36.27 ENC_NANO_R.4 | 112.01,36.27 ENC_NANO_L.14
  Bottom 0.152: US_NANO_R_OUT.4 63.7,79.86 63.7,82.45 62.64,83.52 62.64,85.65 63.4,86.41 66.9,86.41 68.73,84.58 US_NANO_L_OUT.14 69.19,84.58 73.3,80.47 80.92,80.47 81.84,81.38 83.06,81.38 90.37,74.07 94.94,74.07 | US_NANO_L.14 96.93,64.92 101.19,64.92 104.7,61.42 113.23,61.42 113.84,62.03 113.84,68.43 112.17,70.1 US_NANO_R.4 112.01,70.1 108.05,74.07 94.94,74.07 | 94.94,74.07 94.94,75.59 95.86,76.5 113.39,76.5 116.13,73.76 120.4,73.76 USR.4 | C1.2 17.68,97.54 5.03,84.89 5.03,82.3 J1.GND | v120.4,22.55 ENC_RIGHT.1 | 42.67,3.66 43.13,3.66 47.7,8.23 ENC_NANO_R_OUT.4 | ENC_NANO_R.4 96.77,30.94 91.75,25.91 91.75,23.93 GPIO_D22-D53_OUT.36 | 42.67,3.66 41,5.33 40.39,5.33 29.11,16.61 29.11,29.11 18.9,39.32 MOTOR_CONTROLLER.7 | 42.67,3.66 ENC_NANO_L_OUT.14
N$1
  Top 0.152: F1.P$1 14.63,90.53 12.19,90.53 D1.C
N$2
  Top 0.152: D1.A 3.96,92.35 3.96,97.23 S1.3
N$3
  Top 0.152: S1.2 6.71,97.23 6.71,86.41 10.82,82.3 J1.PWR
N$4
  Top 0.152: R3.P$2 15.09,83.21 15.09,78.33 17.68,75.74 R2.P$1
N$5
  Top 0.152: R2.P$2 17.83,83.36 20.57,83.36 R1.P$1 20.57,83.21 20.73,83.06 U1.ADJ
N$6
  Top 0.152: GPIO_D22-D53.1 81.08,66.14 86.72,66.14 87.63,67.06 89.76,67.06 90.68,66.14 GPIO_D22-D53_OUT.2
N$7
  Bottom 0.152: GPIO_D22-D53.2 78.49,66.14 79.7,66.14 80.62,67.06 87.17,67.06 88.09,66.14 GPIO_D22-D53_OUT.1
N$8
  Top 0.152: LED2.A 26.67,91.14 21.64,86.11 R4.P$1
N$9
  Top 0.152: DC-POWER_OUT.1 12.5,12.95 12.5,17.68 POWER.8
N$10
  Top 0.152: ENC_NANO_L_OUT.13 45.26,3.66 45.26,5.94 46.63,7.32 46.63,9.3 49.07,11.73 49.07,14.48 46.94,16.61 46.94,18.9 54.86,26.82 92.66,26.82 96.01,30.18 108.51,30.18 112.01,33.68 ENC_NANO_L.13
N$11
  Bottom 0.152: ENC_NANO_L_OUT.12 50.44,6.25 50.6,6.25 51.82,7.47 51.82,9.45 54.56,12.19 54.56,14.17 55.47,15.09 84.43,15.09 94.94,25.6 94.94,26.52 96.01,27.58 108.36,27.58 ENC_NANO_L.12
N$12
  Bottom 0.152: ENC_NANO_L_OUT.11 50.29,3.66 50.6,3.66 54.25,7.32 54.25,9.3 56.08,11.12 81.99,11.12 96.01,25.15 108.51,25.15 112.01,28.65 ENC_NANO_L.11
N$13
  Top 0.152: ENC_NANO_L_OUT.10 52.88,3.66 53.19,3.66 55.47,5.94 60.5,5.94 61.87,7.32 61.87,9.3 64.77,12.19 64.77,19.05 65.68,19.96 105.61,19.96 111.71,26.06 112.01,26.06 ENC_NANO_L.10
N$14
  Bottom 0.152: ENC_NANO_L_OUT.7 60.5,3.5 60.81,3.5 62.64,1.68 112.62,1.68 113.84,2.9 113.84,16.61 112.01,18.44 ENC_NANO_L.7
N$15
  Bottom 0.152: ENC_NANO_L.6 110.95,14.94 96.01,14.94 87.33,6.25 65.99,6.25 63.4,3.66 63.09,3.66 ENC_NANO_L_OUT.6
N$17
  Bottom 0.152: ENC_NANO_L_OUT.5 65.53,3.66 65.99,3.66 68.28,5.94 89.61,5.94 96.01,12.34 110.95,12.34 112.01,13.41 ENC_NANO_L.5
N$18
  Top 0.152: ENC_NANO_L_OUT.4 68.12,3.66 68.43,3.66 70.1,5.33 78.03,5.33 81.08,2.29 103.48,2.29 112.01,10.82 ENC_NANO_L.4
N$19
  Bottom 0.152: ENC_NANO_L.3 110.95,7.32 96.01,7.32 94.34,5.64 73,5.64 71.02,3.66 70.71,3.66 ENC_NANO_L_OUT.3
N$20
  Bottom 0.152: ENC_NANO_L_OUT.2 73.15,3.66 73.61,3.66 75.29,5.33 95.1,5.33 95.71,4.72 110.95,4.72 112.01,5.79 ENC_NANO_L.2
N$21
  Bottom 0.152: ENC_NANO_L.1 112.01,3.35 98.91,3.35 97.84,4.42 76.5,4.42 75.74,3.66 ENC_NANO_L_OUT.1
N$22
  Top 0.152: ENC_NANO_R_OUT.15 80.47,3.35 96.77,3.35 ENC_NANO_R.15
N$23
  Top 0.152: ENC_NANO_R.14 96.77,5.94 92.35,5.94 88.39,9.91 74.83,9.91 73.15,8.23 ENC_NANO_R_OUT.14
N$24
  Top 0.152: ENC_NANO_R.13 94.94,10.21 73,10.21 71.02,8.23 70.71,8.23 ENC_NANO_R_OUT.13
N$26
  Top 0.152: ENC_NANO_R_OUT.12 68.12,8.23 68.43,8.23 70.71,10.52 96.47,10.52 96.77,10.82 ENC_NANO_R.12
N$27
  Top 0.152: ENC_NANO_R_OUT.11 65.53,8.23 65.99,8.23 68.58,10.82 94.18,10.82 96.77,13.41 ENC_NANO_R.11
N$28
  Top 0.152: ENC_NANO_R_OUT.6 52.88,8.23 53.19,8.23 55.78,10.82 58.22,10.82 59.59,12.19 59.59,18.9 62.48,21.79 92.51,21.79 96.77,26.06 ENC_NANO_R.6
N$29
  Top 0.152: ENC_NANO_R_OUT.5 50.29,8.08 50.6,8.08 52.43,6.25 58.22,6.25 59.44,7.47 59.44,9.45 62.18,12.19 62.18,18.9 64.77,21.49 94.94,21.49 96.01,22.55 97.99,22.55 98.6,23.16 98.6,26.82 96.77,28.65 ENC_NANO_R.5
N$30
  Bottom 0.152: ENC_NANO_R_OUT.3 45.26,8.23 45.57,8.23 49.53,12.19 49.53,14.17 50.75,15.39 76.66,15.39 88.09,26.82 90.98,26.82 94.94,30.79 94.94,31.85 96.77,33.68 ENC_NANO_R.3
N$31
  Bottom 0.152: ENC_NANO_R_OUT.2 42.67,8.23 42.98,8.23 46.94,12.19 46.94,14.17 48.46,15.7 60.81,15.7 62.18,17.07 62.18,18.9 77.72,34.44 94.94,34.44 96.77,36.27 ENC_NANO_R.2
N$32
  Bottom 0.152: ENC_NANO_R_OUT.1 43.13,11.12 43.28,11.12 44.35,12.19 44.35,14.02 46.33,16 54.1,16 75.13,37.03 94.94,37.03 ENC_NANO_R.1
N$33
  Top 0.152: US_NANO_R_OUT.15 35.81,79.86 39.78,83.82 39.78,85.65 51.05,96.93 110.95,96.93 112.01,97.99 US_NANO_R.15
N$34
  Bottom 0.152: US_NANO_R_OUT.14 38.41,79.86 42.37,83.82 42.37,85.8 51.05,94.49 111.1,94.49 112.01,95.4 US_NANO_R.14
N$35
  Bottom 0.152: US_NANO_R_OUT.11 46.02,79.86 46.02,82.45 47.4,83.82 47.4,85.65 50.75,89 110.95,89 112.01,87.94 US_NANO_R.11
N$36
  Bottom 0.152: US_NANO_R_OUT.10 48.62,79.86 48.62,82.45 49.99,83.82 49.99,85.8 52.43,88.24 94.18,88.24 96.01,86.41 110.95,86.41 112.01,85.34 US_NANO_R.10
N$37  (via drill 0.35)
  Top 0.152: v80.01,81.08 76.81,77.88 53.19,77.88 51.36,79.7 51.05,79.7 US_NANO_R_OUT.9
  Bottom 0.152: v80.01,81.08 81.08,81.08 81.69,81.69 83.21,81.69 86.11,78.79 98.91,78.79 99.36,78.33 107.59,78.33 112.01,82.75 US_NANO_R.9
N$38
  Top 0.152: US_NANO_R_OUT.8 53.65,79.86 53.95,79.86 56.08,81.99 81.84,81.99 82.75,81.08 82.75,75.89 94.64,64.01 94.64,62.03 95.56,61.11 98.15,61.11 105.16,68.12 105.16,79.25 106.07,80.16 112.01,80.16 US_NANO_R.8
N$39  (via drill 0.35)
  Top 0.152: v105.77,78.94 112.01,72.69 US_NANO_R.5
  Bottom 0.152: v105.77,78.94 99.21,78.94 98.91,79.25 86.11,79.25 78.64,86.72 63.25,86.72 62.33,85.8 62.33,80.92 61.27,79.86 US_NANO_R_OUT.5
N$40  (via drill 0.35)
  Top 0.152: v82.14,80.77 81.23,80.77 80.31,81.69 68.12,81.69 66.29,79.86 US_NANO_R_OUT.3
  Bottom 0.152: v82.14,80.77 83.21,80.77 90.22,73.76 97.99,73.76 104.09,67.67 112.01,67.67 US_NANO_R.3
N$41  (via drill 0.35)
  Top 0.152: v80.01,78.18 91.75,66.45 91.75,64.47 95.4,60.81 98.3,60.81 102.41,64.92 112.01,64.92 US_NANO_R.2
  Bottom 0.152: v80.01,78.18 72.08,78.18 71.78,77.88 70.71,77.88 US_NANO_R_OUT.2
N$42
  Bottom 0.152: US_NANO_R.1 104.09,62.48 97.54,69.04 94.03,69.04 83.36,79.7 71.48,79.7 US_NANO_R_OUT.1
N$43
  Top 0.152: US_NANO_L_OUT.1 36.12,84.58 49.53,97.99 96.77,97.99 US_NANO_L.1
N$44
  Bottom 0.152: US_NANO_L_OUT.2 38.71,84.58 49.53,95.4 96.77,95.4 US_NANO_L.2
N$45
  Top 0.152: US_NANO_L.3 49.38,92.96 41,84.58 US_NANO_L_OUT.3
N$46
  Top 0.152: US_NANO_L_OUT.4 44.65,85.8 44.65,85.95 49.07,90.37 96.77,90.37 US_NANO_L.4
N$47
  Top 0.152: US_NANO_L_OUT.5 46.33,84.58 49.53,87.78 96.77,87.78 US_NANO_L.5
N$48
  Top 0.152: US_NANO_L_OUT.6 48.62,84.58 50.75,86.72 73,86.72 74.52,85.19 96.62,85.19 96.77,85.34 US_NANO_L.6
N$49
  Bottom 0.152: US_NANO_L_OUT.7 54.41,87.94 87.94,87.94 92.96,82.91 96.77,82.91 US_NANO_L.7
N$50
  Bottom 0.152: US_NANO_L.12 93.42,70.1 83.36,80.16 73.15,80.16 70.56,82.75 65.68,82.75 63.86,84.58 US_NANO_L_OUT.12
N$51  (via drill 0.35)
  Top 0.152: v99.21,66.45 99.21,76.96 v101.8,79.55 | v101.8,82.6 97.99,86.41 75.44,86.41 v74.83,85.8 | v72.69,83.67 71.78,82.75 68.12,82.75 US_NANO_L_OUT.13
  Bottom 0.152: v99.21,66.45 98.15,67.51 96.93,67.51 US_NANO_L.13 | v101.8,82.6 v101.8,79.55 | v72.69,83.67 v74.83,85.8
N$52
  Top 0.152: DC-POWER_OUT.2 15.09,12.95 15.09,17.68 POWER.7
N$53
  Top 0.152: POWER.6 DC-POWER_OUT.3
N$54
  Top 0.152: DC-POWER_OUT.4 20.12,12.95 20.12,17.68 POWER.5
N$55
  Top 0.152: DC-POWER_OUT.5 22.71,12.95 22.71,17.68 POWER.4
N$56
  Top 0.152: POWER.3 DC-POWER_OUT.6
N$57
  Top 0.152: DC-POWER_OUT.7 27.74,12.95 27.74,17.68 POWER.2
RAW
  Top 0.152: C1.1 20.27,97.54 20.27,90.98 19.81,90.53 F1.P$2
  Bottom 0.152: U1.IN 27.43,78.94 19.81,86.56 F1.P$2
SCL  (via drill 0.35)
  Top 0.152: DC-COMMS.12 70.87,70.1 COMMS_D14-D21.1 70.87,55.63 34.29,19.05 34.29,11.58 41.6,4.27 41.6,2.44 42.37,1.68 53.49,1.68 ENC_NANO_L_OUT.9 55.47,3.5 55.78,3.5 57.61,1.68 118.72,1.68 122.22,5.18 122.22,13.56 112.17,23.62 ENC_NANO_L.9 | 85.5,77.72 US_NANO_L.9 | v84.73,76.96 85.5,77.72 | 85.5,77.72 v85.5,80.77
  Bottom 0.152: v84.73,76.96 77.72,76.96 DC-COMMS.12 | v85.5,80.77 79.25,87.02 58.67,87.02 56.24,84.58 US_NANO_L_OUT.9
SCL1
  Bottom 0.152: GPIO_D8-D13.10 3.35,65.99 3.66,65.99 5.49,64.16 21.49,64.16 22.55,65.23 22.55,67.21 25.91,70.56 43.43,70.56 DC-COMMS.1
SDA
  Top 0.152: COMMS_D14-D21.2 68.43,66.14 68.43,70.26 68.73,70.56 DC-COMMS.11 68.89,70.71 72.39,74.22 72.39,76.66 71.78,77.27 51.36,77.27 49.99,78.64 49.99,81.08 53.49,84.58 US_NANO_L_OUT.8
  Bottom 0.152: US_NANO_L_OUT.8 53.49,84.58 56.54,87.63 87.78,87.63 95.1,80.31 96.77,80.31 US_NANO_L.8 96.93,80.31 98.6,80.31 102.11,83.82 120.09,83.82 122.53,81.38 122.53,25.6 115.82,18.9 114.15,18.9 | 114.15,18.9 114.15,2.74 112.78,1.37 60.35,1.37 58.22,3.5 57.91,3.5 ENC_NANO_L_OUT.8 | 114.15,18.9 112.01,21.03 ENC_NANO_L.8
SDA1
  Bottom 0.152: DC-COMMS.2 44.2,72.39 42.98,72.39 41.6,71.02 11.12,71.02 6.25,66.14 5.94,66.14 GPIO_D8-D13.9
TRIG_C
  Top 0.152: USC.2 120.4,95.4 117.04,95.4 112.17,90.53 US_NANO_R.12
  Bottom 0.152: US_NANO_R_OUT.12 43.43,82.3 44.96,83.82 44.96,85.8 48.46,89.31 110.95,89.31 112.01,90.37 US_NANO_R.12
TRIG_L
  Top 0.152: US_NANO_L_OUT.10 58.98,84.58 61.27,82.3 81.99,82.3 83.06,81.23 83.06,76.05 94.94,64.16 94.94,62.18 95.71,61.42 97.99,61.42 98.6,62.03 98.6,73.46 96.93,75.13 US_NANO_L.10
  Bottom 0.152: US_NANO_L.10 96.93,75.29 109.88,75.29 110.8,76.2 113.23,76.2 118.57,70.87 118.57,64.16 120.4,62.33 USL.2
TRIG_R
  Top 0.152: USR.2 120.4,79.1 113.84,85.65 113.84,88.39 112.93,89.31 110.95,89.31 110.19,90.07 | 110.19,90.07 110.19,91.14 112.01,92.96 US_NANO_R.13 | US_NANO_R_OUT.13 44.96,83.82 44.96,85.8 48.46,89.31 109.42,89.31 110.19,90.07
VCC
  Top 0.152: USC.1 120.4,97.69 122.22,95.86 122.22,95.1 121.16,94.03 119.18,94.03 118.57,93.42 118.57,83.21 120.4,81.38 USR.1 | ENC_RIGHT.2 120.4,10.97 113.84,17.53 113.84,21.49 112.78,22.55 110.8,22.55 110.19,23.16 110.19,24.08 111.25,25.15 114.91,25.15 120.4,30.63 ENC_LEFT.2 | 12.34,72.54 13.56,72.54 C3.1 | 12.34,72.54 8.69,72.54 C2.1 | U1.OUT 27.43,80.47 25.3,80.47 20.57,75.74 R1.P$2 | 30.33,12.95 30.33,17.68 POWER.1 | 30.33,12.95 39.62,3.66 40.08,3.66 ENC_NANO_L_OUT.15 | 30.33,12.95 DC-POWER_OUT.8 | 12.34,72.54 12.34,48.31 18.75,41.91 MOTOR_CONTROLLER.8
  Bottom 0.152: USR.1 120.4,81.23 122.22,79.4 122.22,73.3 120.4,71.48 USL.1 120.4,64.47 122.22,62.64 122.22,48.77 112.32,38.86 | 112.32,38.86 120.4,30.79 ENC_LEFT.2 | 112.32,38.86 ENC_NANO_L.15 99.06,38.86 97.99,39.93 91.44,39.93 90.68,39.17 39.17,39.17 30.18,30.18 | 19.2,75.59 19.05,75.59 15.39,71.93 14.33,71.93 C3.1 | 19.2,75.59 20.57,75.59 R1.P$2 | 19.2,75.59 14.02,80.77 14.02,86.11 R4.P$2 | 30.18,30.18 18.9,41.45 18.9,41.91 MOTOR_CONTROLLER.8 | 30.18,30.18 30.18,17.83 POWER.1
VCC1
  Top 0.152: US_NANO_L_OUT.15 80.16,84.58 83.36,81.38 83.36,76.2 96.77,62.79 96.77,62.48 US_NANO_L.15

### Text on the board
tPlace: US CENTER | Power Supply | Ultrasonic / Nano | US RIGHT | DC PWM | D13 | D12 | D11 | D10 | 2PWM | 2INA | 2INB | D6 | 1PWM | D4 | 1INA | 1INB | SCL1 | SDA1 | TX0 | RX0 | TX3 | RX3 | TX2 | RX2 | TX1 | RX1 | SDA | SCL | DC Comms | D22 | Ultrasonic Nano | US LEFT | ENC RIGHT | D53 | ENC LEFT | Drive Controller / Power/Analog | Encoder / Nano | Encoder Nano
bPlace: Arduino Mega 2560 / Drive Controller